# EAGLE schematic FidoBark (EAGLE 7.2.0)
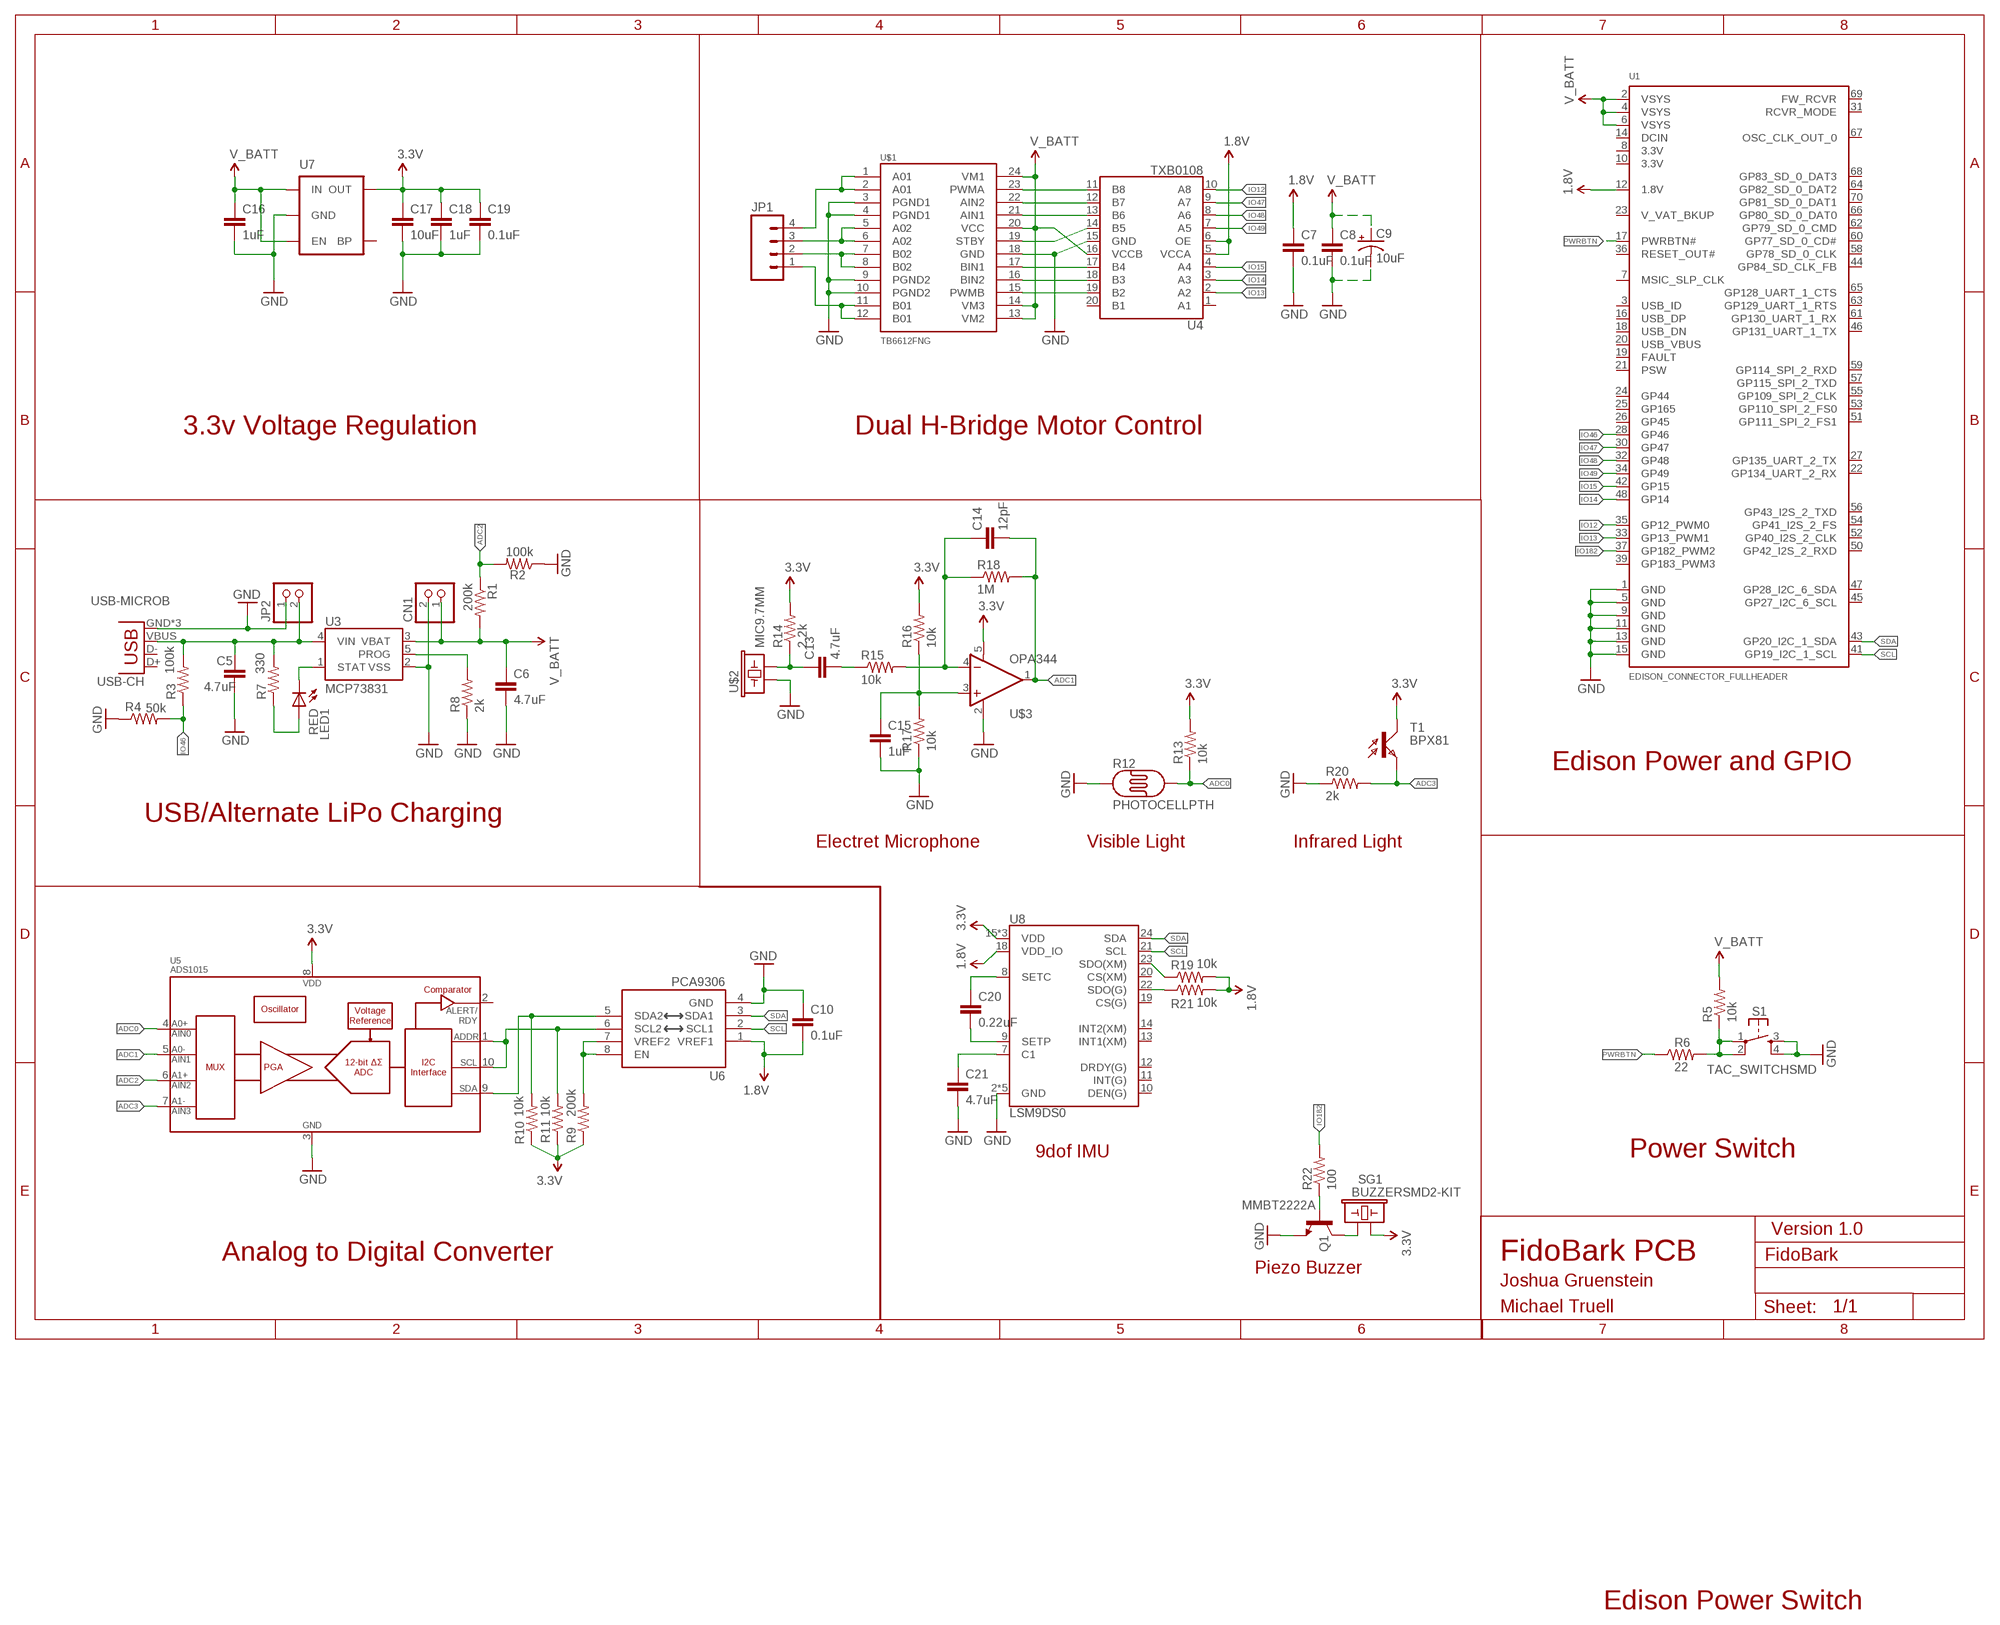
[diagram p0: schematic, sheet 1]

## Parts
C5  4.7uF  CAP0603-CAP  [0603-CAP]
C6  4.7uF  CAP0603-CAP  [0603-CAP]
C7  0.1uF  CAP0603-CAP  [0603-CAP]
C8  0.1uF  CAP0603-CAP  [0603-CAP]
C9  10uF  CAP_POL1206  [EIA3216]
C10  0.1uF  CAP0603-CAP  [0603-CAP]
C13  4.7uF  CAP0603-CAP  [0603-CAP]
C14  12pF  CAP0603-CAP  [0603-CAP]
C15  1uF  CAP0603-CAP  [0603-CAP]
C16  1uF  CAP0603-CAP  [0603-CAP]
C17  10uF  CAP0603-CAP  [0603-CAP]
C18  1uF  CAP0603-CAP  [0603-CAP]
C19  0.1uF  CAP0603-CAP  [0603-CAP]
C20  0.22uF  CAP0603-CAP  [0603-CAP]
C21  4.7uF  CAP0603-CAP  [0603-CAP]
CN1  JST_2PIN-SMT-RA  [JST-PH-2-SMT-RA]
JP1  M04PTH  [1X04]
JP2  PINHD-1X2  [1X02]
LED1  RED  LEDCHIP-LED0603  [CHIP-LED0603]
Q1  MMBT2222A  TRANSISTOR_NPNMMBT2222A  [SOT23-3]
R1  200k  R-US_R0603  [R0603]
R2  100k  R-US_R0603  [R0603]
R3  100k  R-US_R0603  [R0603]
R4  50k  R-US_R0603  [R0603]
R5  10k  R-US_R0603  [R0603]
R6  22  R-US_R0603  [R0603]
R7  330  R-US_R0603  [R0603]
R8  2k  R-US_R0603  [R0603]
R9  200k  R-US_R0603  [R0603]
R10  10k  R-US_R0603  [R0603]
R11  10k  R-US_R0603  [R0603]
R12  PHOTOCELLPTH  [PHOTOCELL]
R13  10k  R-US_R0603  [R0603]
R14  2.2k  R-US_R0603  [R0603]
R15  10k  R-US_R0603  [R0603]
R16  10k  R-US_R0603  [R0603]
R17  10k  R-US_R0603  [R0603]
R18  1M  R-US_R0603  [R0603]
R19  10k  R-US_R0603  [R0603]
R20  2k  R-US_R0603  [R0603]
R21  10k  R-US_R0603  [R0603]
R22  100  R-US_R0603  [R0603]
S1  TAC_SWITCHSMD  [TACTILE-SWITCH-SMD]
SG1  BUZZERSMD2-KIT  [BUZZER-CCV-KIT]
T1  BPX81  [BPX81]
U1  EDISON_CONNECTOR_FULLHEADER  [DF40C-70DP-0.4(51)]
U3  MCP73831  [SOT23-5]
U4  TXB0108  [UFDFN-20]
U5  ADS1015  [MSOP10]
U6  PCA9306  [PSOP-8]
U7  MIC52053.3V  [SOT23-5]
U8  LSM9DS0  [LGA-24]
U$1  TB6612FNG  [SSOP24]
U$2  MIC9.7MM  [MIC-9.7MM]
U$3  OPA344  [SOT23-5]
USB-CH  USB-MICROB  [USB-MICROB]

## Nets
1.8V: C7.1 C10.2 R19.2 R21.2 U1.12(1.8V) U4.5(VCCA) U4.6(OE) U6.1(VREF1) U8.18(VDD_IO)
3.3V: C17.1 C18.1 C19.1 R9.1 R10.1 R11.1 R13.2 R14.2 R16.2 SG1.- T1.C U5.8(VDD) U7.5(OUT) U8.15(VDD) U8.16(VDD) U8.17(VDD) U$3.5(V+)
ADC0: R12.2 R13.1 U5.4(AIN0)
ADC1: C14.2 R18.2 U5.5(AIN1) U$3.1(OUT)
ADC2: R1.1 R2.2 U5.6(AIN2)
ADC3: R20.2 T1.E U5.7(AIN3)
GND: C5.2 C6.2 C7.2 C8.2 C9.C(-) C10.1 C15.2 C16.2 C17.2 C18.2 C19.2 C21.2 CN1.2 JP2.1 Q1.2(E) R2.1 R4.1 R8.1 R12.1 R17.1 R20.1 S1.3 S1.4 U1.1(GND) U1.5(GND) U1.9(GND) U1.11(GND) U1.13(GND) U1.15(GND) U3.2(VSS) U4.15(GND) U5.3(VSS) U6.4(GND) U7.2(GND) U8.2(GND) U8.3(GND) U8.4(GND) U8.5(GND) U8.6(GND) U$1.3(PGND1) U$1.4(PGND1) U$1.9(PGND2) U$1.10(PGND2) U$1.18(GND) U$2.1 U$3.2(V-) USB-CH.GND USB-CH.MT1(GND) USB-CH.MT2(GND)
IO12: U1.35(GP12_PWM0) U4.10(A8)
IO13: U1.33(GP13_PWM1) U4.2(A2)
IO14: U1.48(GP14) U4.3(A3)
IO15: U1.42(GP15) U4.4(A4)
IO46: R3.1 R4.2 U1.28(GP46)
IO47: U1.30(GP47) U4.9(A7)
IO48: U1.32(GP48) U4.8(A6)
IO49: U1.34(GP49) U4.7(A5)
IO182: R22.2 U1.37(GP182_PWM2)
N$7: R5.1 R6.2 S1.1 S1.2
N$8: LED1.A R7.1
N$9: LED1.C U3.1(STAT)
N$10: R8.2 U3.5(PROG)
N$11: JP1.3 U$1.5(A02) U$1.6(A02)
N$12: C5.1 JP2.2 R3.2 R7.2 U3.4(VIN) USB-CH.VBUS
N$13: JP1.2 U$1.7(B02) U$1.8(B02)
N$14: R11.2 U5.1(ADDR) U5.10(SCL) U6.6(SCL2)
N$15: U4.11(B8) U$1.23(PWMA)
N$16: U4.12(B7) U$1.22(AIN2)
N$17: JP1.1 U$1.11(B01) U$1.12(B01)
N$18: JP1.4 U$1.1(A01) U$1.2(A01)
N$19: U4.13(B6) U$1.21(AIN1)
N$20: U4.14(B5) U$1.19(STBY)
N$21: U4.17(B4) U$1.17(BIN1)
N$22: U4.18(B3) U$1.16(BIN2)
N$23: U4.19(B2) U$1.15(PWMB)
N$24: R10.2 U5.9(SDA) U6.5(SDA2)
N$25: R9.2 U6.7(VREF2) U6.8(EN)
N$26: C20.1 U8.8(SETC)
N$27: C20.2 U8.9(SETP)
N$28: C13.1 R14.1 U$2.2
N$29: C13.2 R15.1
N$30: C14.1 R15.2 R18.1 U$3.4(-IN)
N$31: C21.1 U8.7(C1)
N$32: C15.1 R16.1 R17.2 U$3.3(+IN)
N$33: R21.1 U8.22(SDO(G))
N$34: R19.1 U8.23(SDO(XM))
N$35: Q1.1(B) R22.1
N$36: Q1.3(C) SG1.+
PWRBTN: R6.1 U1.17(PWRBTN#)
SCL: U1.41(GP19_I2C_1_SCL) U6.2(SCL1) U8.21(SCL)
SDA: U1.43(GP20_I2C_1_SDA) U6.3(SDA1) U8.24(SDA)
V_BATT: C6.1 C8.1 C9.A(+) C16.1 CN1.1 R1.2 R5.2 U1.2(VSYS) U1.4(VSYS) U1.6(VSYS) U3.3(VBAT) U4.16(VCCB) U7.1(IN) U7.3(EN) U$1.13(VM2) U$1.14(VM3) U$1.20(VCC) U$1.24(VM1)
Unconnected: U1.3(USB_ID) U1.7(MSIC_SLP_CLK) U1.8(3.3V) U1.10(3.3V) U1.14(DCIN) U1.16(USB_DP) U1.18(USB_DN) U1.19(FAULT) U1.20(USB_VBUS) U1.21(PSW) U1.22(GP134_UART_2_RX) U1.23(V_VAT_BKUP) U1.24(GP44) U1.25(GP165) U1.26(GP45) U1.27(GP135_UART_2_TX) U1.31(RCVR_MODE) U1.36(RESET_OUT#) U1.39(GP183_PWM3) U1.44(GP84_SD_CLK_FB) U1.45(GP27_I2C_6_SCL) U1.46(GP131_UART_1_TX) U1.47(GP28_I2C_6_SDA) U1.50(GP42_I2S_2_RXD) U1.51(GP111_SPI_2_FS1) U1.52(GP40_I2S_2_CLK) U1.53(GP110_SPI_2_FS0) U1.54(GP41_I2S_2_FS) U1.55(GP109_SPI_2_CLK) U1.56(GP43_I2S_2_TXD) U1.57(GP115_SPI_2_TXD) U1.58(GP78_SD_0_CLK) U1.59(GP114_SPI_2_RXD) U1.60(GP77_SD_0_CD#) U1.61(GP130_UART_1_RX) U1.62(GP79_SD_0_CMD) U1.63(GP129_UART_1_RTS) U1.64(GP82_SD_0_DAT2) U1.65(GP128_UART_1_CTS) U1.66(GP80_SD_0_DAT0) U1.67(OSC_CLK_OUT_0) U1.68(GP83_SD_0_DAT3) U1.69(FW_RCVR) U1.70(GP81_SD_0_DAT1) U4.1(A1) U4.20(B1) U5.2(ALERT/RDY) U7.4(BP) U8.10(DEN(G)) U8.11(INT(G)) U8.12(DRDY(G)) U8.13(INT1(XM)) U8.14(INT2(XM)) U8.19(CS(G)) U8.20(CS(XM)) USB-CH.D+ USB-CH.D-

## Notes on the sheet
- 3.3v Voltage Regulation | Dual H-Bridge Motor Control
- Edison Power and GPIO
- USB/Alternate LiPo Charging
- Electret Microphone | Visible Light | Infrared Light
- 9dof IMU | Power Switch
- Version 1.0
- Analog to Digital Converter | FidoBark PCB
- Piezo Buzzer
- Joshua Gruenstein
- Michael Truell
- Edison Power Switch

## Library data of the parts
C5 C6 C10 C13-C21 = SparkFun-Passives:CAP: Capacitor Standard 0603 ceramic capacitor, and 0.1" leaded capacitor.
C7 C8 = SparkFun-Capacitors:CAP: Capacitor Standard 0603 ceramic capacitor, and 0.1" leaded capacitor.
C9 = SparkFun-Capacitors:CAP_POL: Capacitor Polarized These are standard SMD and PTH capacitors. Normally 10uF, 47uF, and 100uF in electrolytic and tantalum varieties. Always verify the external diameter of the through hole cap, it varies with capacity, voltage, and manufacturer. The EIA devices should be standard.
CN1 = adafruit:JST_2PIN: JST 2-Pin Connectors of various flavors SMT-RA (S2B-PH-SM4) 4UConnector #17311 SMT (B2B-PH-SM4) THM-RA (S2B-PH) THM (B2B-PH)
JP1 = SparkFun-Connectors:M04: Header 4 Standard 4-pin 0.1" header. Use with straight break away headers (SKU : PRT-00116), right angle break away headers (PRT-00553), swiss pins (PRT-00743), machine pins (PRT-00117), and female headers (PRT-00115). Molex polarized connector foot print use with SKU : PRT-08231 with associated crimp pins and housings. 1MM SMD Version SKU: PRT-10208
JP2 = pinhead:PINHD-1X2: PIN HEADER
LED1 = adafruit:LED: LED OSRAM: - CHIPLED LG R971, LG N971, LY N971, LG Q971, LY Q971, LO R971, LY R971 LH N974, LH R974 LS Q976, LO Q976, LY Q976 LO Q996 - Hyper CHIPLED LW Q18S LB Q993, LB Q99A, LB R99A - SideLED LS A670, LO A670, LY A670, LG A670, LP A670 LB A673, LV A673, LT A673, LW A673 LH A674 LY A675 LS A676, LA A676, LO A676, LY A676, LW A676 LS A679, LY A679, LG A679 - Hyper Micro SIDELED® LS Y876, LA Y876, LO Y876, LY Y876 LT Y87S - SmartLED LW L88C, LW L88S LB L89C, LB L89S, LG L890 LS L89K, LO L89K, LY L89K LS L896, LA L896, LO L896, LY L896 - TOPLED LS T670, LO T670, LY T670, LG T670, LP T670 LSG T670, LSP T670, LSY T670, LOP T670, LYG T670 LG T671, LOG T671, LSG T671 LB T673, LV T673, LT T673, LW T673 LH T674 LS T676, LA T676, LO T676, LY T676, LB T676, LH T676, LSB T676, LW T676 LB T67C, LV T67C, LT T67C, LS T67K, LO T67K, LY T67K, LW E67C LS E67B, LA E67B, LO E67B, LY E67B, LB E67C, LV E67C, LT E67C LW T67C LS T679, LY T679, LG T679 LS T770, LO T770, LY T770, LG T770, LP T770 LB T773, LV T773, LT T773, LW T773 LH T774 LS E675, LA E675, LY E675, LS T675 LS T776, LA T776, LO T776, LY T776, LB T776 LHGB T686 LT T68C, LB T68C - Hyper Mini TOPLED® LB M676 - Mini TOPLED Santana® LG M470 LS M47K, LO M47K, LY M47K Source: http://www.osram.convergy.de/
Q1 = SparkFun-DiscreteSemi:TRANSISTOR_NPN: Generic NPN BJT MMBT2222A - TRANS-08049 (SOT-23, 1A 40V) MPSA42 - TRANS-09116 (SOT-23, 500mA 300V) MMBT5088LT1G - TRANS-11160 (SOT-23, 50 mA 30V) BC547 - COM-08928 <http://www.sparkfun.com/products/8928> (TO-92 45V 100mA) (1.Collector 2.Base 3.Emitter) 2N3904 - COM-00521 <http://www.sparkfun.com/products/521> (TO-92 40V 200mA) (1.Emitter 2.Base 3.Collector) P2N2222A - COM-12852 <http://www.sparkfun.com/products/12852> (TO-92 40V 600mA) (1.Collector 2.Base 3.Emitter); PROD_ID: TRANS-08049
R1-R11 R13-R22 = adafruit:R-US_: RESISTOR, American symbol
R12 = SparkFun-Sensors:PHOTOCELL: CdS photoresistor. This is a low cost way to detect light levels. Resistance decreases with more incoming light. SparkFun SKU: SEN-09088
S1 = SparkFun-Retired:TAC_SWITCH: Momentary Switch Button commonly used for reset or general input. Spark Fun Electronics SKU : COM-00097 SMT- SWCH-08247; PROD_ID: SWCH-08247
SG1 = SparkFun-Electromechanical:BUZZER: Buzzer 12mm Spark Fun Electronics SKU : Comp-Buzzer
T1 = opto-trans-siemens:BPX81: PHOTO TRANSISTOR; OC_FARNELL: unknown; OC_NEWARK: unknown
U1 = Edison:EDISON_CONNECTOR_FULL
U3 = SparkFun-PowerIC:MCP73831: Miniature single cell, fully integrated Li-Ion, Li-polymer charge management controller http://ww1.microchip.com/downloads/en/DeviceDoc/20001984g.pdf IC-09995; PROD_ID: IC-09995
U4 = SparkFun-DigitalIC:TXB0108: 8-Bit Bi-Directional Level Shifter 1.2V-3.6V (VCCA) to 1.65V-5.5V (VCCB) bi-directional level shifter with auto direction sensing. Max data rate - VCCA 1.2V: 20Mbps (50ns), VCCA 3.3V: 100Mbps (10ns) Digikey: 296-27217-1-ND (20-UFDFN) IC-12292; PROD_ID: IC-12292
U5 = SparkFun-AnalogIC:ADS1015: 12-Bit Del-Sig ADC Four single-ended inputs or two differential inputs Internal PGA I2C interface 2.0-5.5V; PROD_ID: IC-12239
U6 = SparkFun-DigitalIC:PCA9306: Bidirectional I2C level shifter. NOT compatible with all available part number pinout schemes- DOUBLE CHECK!!!; PROD_ID: IC-10023
U7 = SparkFun-PowerIC:MIC5205: MIC5205 150mA vreg 3.3V - VREG-00822 5V - VREG-00823; PROD_ID: VREG-00822
U8 = SparkFun-DigitalIC:LSM9DS0: LSM9DS0 3D Accelerometer, 3D Gyroscope, 3D Magnetomter Features: 3 acceleration channels, 3 angular rate channels, 3 magnetic field channels ±2/±4/±6/±8/±16 g linear acceleration full scale ±2/±4/±8/±12 gauss magnetic full scale ±245/±500/±2000 dps angular rate full scale 16-bit data output SPI / I2C serial interfaces Analog supply voltage 2.4 V to 3.6 V Power-down mode / low-power mode Programmable interrupt generators Embedded self-test Embedded temperature sensor Embedded FIFO Position and motion detection functions Click/double-click recognition
U$1 = SparkFun-PowerIC:TB6612FNG: Toshiba 1A dual motor driver IC-09363; PROD_ID: IC-09363
U$2 = SparkFun-Sensors:MIC: Omni-directional electret microphone. 9.7mm standard diameter.; PROD_ID: COMP-08856
U$3 = SparkFun-AnalogIC:OPA344: Single gate rail-to-rail output op-amp. Inputs extend 300mV past rails.
USB-CH = SparkFun-Connectors:USB: USB Connectors USB-B-PTH is fully proven SKU : PRT-00139/CONN-08278 USB-miniB is fully proven SKU : PRT-00587 USB-A-PCB is untested. USB-A-H is throughly reviewed, but untested. Spark Fun Electronics SKU : PRT-00437 USB-B-SMT is throughly reviewed, but untested. Needs silkscreen touching up. USB-A-S has not been used/tested USB-MB-H has not been used/tested USB-MICROB has been used. CONN-09505; PROD_ID: CONN-09505